# EAGLE design Thermostat-V7 (EAGLE 5.11)
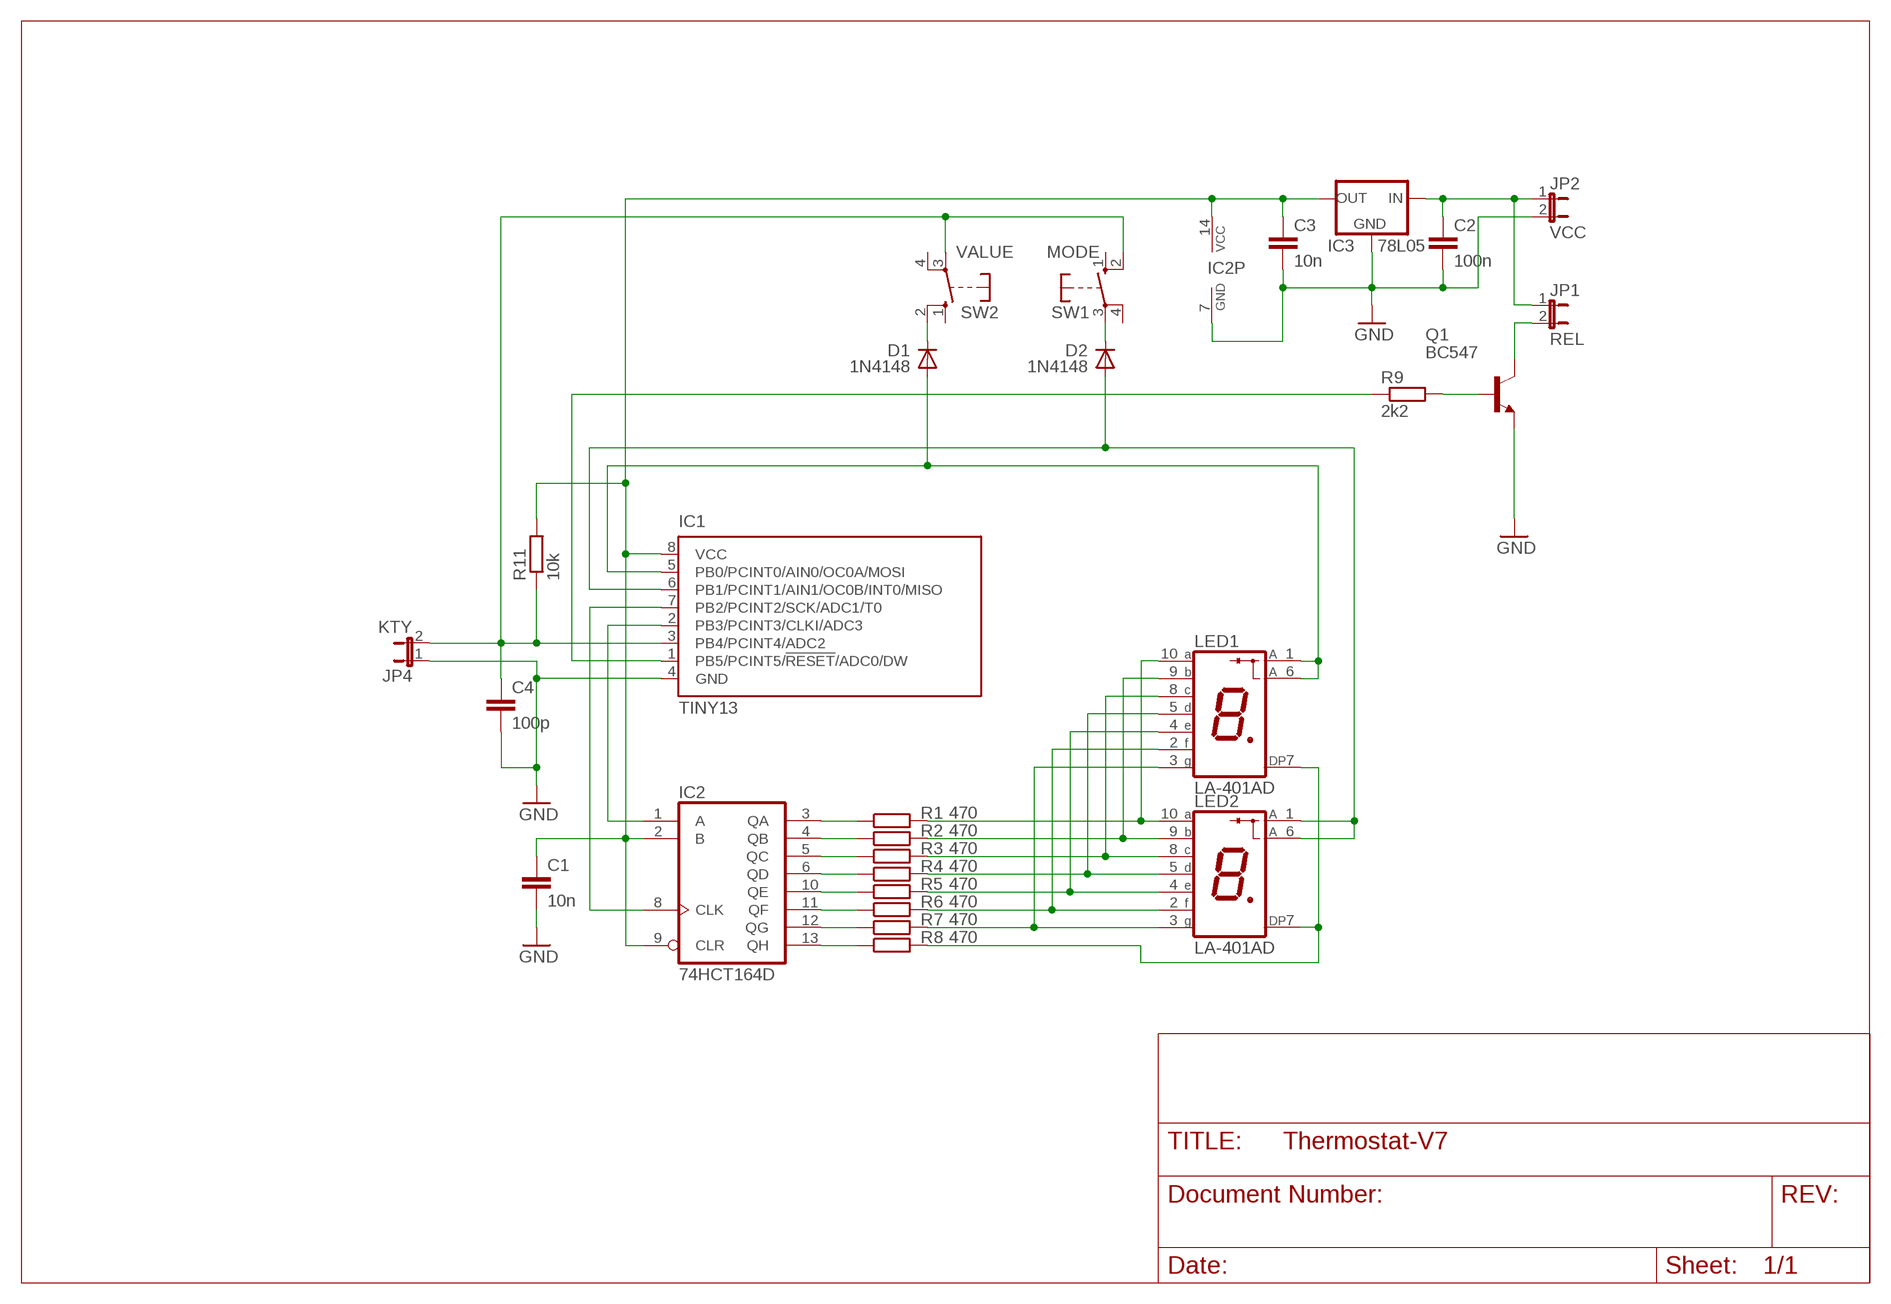
[diagram p0: schematic, sheet 1]

## Parts
C1  10n  C-EU025-024X044  [C025-024X044]
C2  100n  C-EU025-024X044  [C025-024X044]
C3  10n  C-EU025-024X044  [C025-024X044]
C4  100p  C-EU025-024X044  [C025-024X044]
D1  1N4148  1N4148DO35-7  [DO35-7]
D2  1N4148  1N4148DO35-7  [DO35-7]
IC1  TINY13  TINY13-20SU  [8S2]
IC2  74HCT164D  [SO14]
IC3  78L05  78LXX  [78LXX]
JP1  REL  JP1E  [JP1]
JP2  VCC  JP1E  [JP1]
JP4  KTY  JP1E  [JP1]
LED1  LA-401AD  [LA-401]
LED2  LA-401AD  [LA-401]
Q1  BC547  [TO92]
R1  470  R-EU_0204/5  [0204/5]
R2  470  R-EU_0204/5  [0204/5]
R3  470  R-EU_0204/5  [0204/5]
R4  470  R-EU_0204/5  [0204/5]
R5  470  R-EU_0204/5  [0204/5]
R6  470  R-EU_0204/5  [0204/5]
R7  470  R-EU_0204/5  [0204/5]
R8  470  R-EU_0204/5  [0204/5]
R9  2k2  R-EU_0204/5  [0204/5]
R11  10k  R-EU_0204/5  [0204/5]
SW1  MODE  DT6  [DT6]
SW2  VALUE  DT6  [DT6]

## Nets
GND: C1.2 C2.2 C3.2 C4.2 IC1.4(GND) IC2.7(GND) IC3.GND JP2.2 JP4.1 Q1.1(E)
N$1: IC2.3(QA) R1.1
N$2: IC2.4(QB) R2.1
N$3: IC2.5(QC) R3.1
N$4: IC2.6(QD) R4.1
N$5: IC2.10(QE) R5.1
N$6: IC2.11(QF) R6.1
N$7: IC2.12(QG) R7.1
N$8: IC2.13(QH) R8.1
N$9: LED1.10(A) LED2.10(A) R1.2
N$10: LED1.9(B) LED2.9(B) R2.2
N$11: LED1.8(C) LED2.8(C) R3.2
N$12: LED1.5(D) LED2.5(D) R4.2
N$13: LED1.4(E) LED2.4(E) R5.2
N$14: LED1.2(F) LED2.2(F) R6.2
N$15: LED1.3(G) LED2.3(G) R7.2
N$16: LED1.7(DP) LED2.7(DP) R8.2
N$17: C4.1 IC1.3(PB4/PCINT4/ADC2) JP4.2 R11.1 SW1.2(S) SW2.3(P)
N$18: D1.C SW2.2(S)
N$19: D2.C SW1.3(P)
N$23: C2.1 IC3.IN JP1.1 JP2.1
N$26: Q1.2(B) R9.2
N$27: JP1.2 Q1.3(C)
RESET: IC1.1(PB5/PCINT5/!RESET!/ADC0/DW) R9.1
SCI: IC1.2(PB3/PCINT3/CLKI/ADC3) IC2.1(A)
SDI: D1.A IC1.5(PB0/PCINT0/AIN0/OC0A/MOSI) LED1.1(A) LED1.6(A)
SDO: IC1.7(PB2/PCINT2/SCK/ADC1/T0) IC2.8(CLK)
SII: D2.A IC1.6(PB1/PCINT1/AIN1/OC0B/INT0/MISO) LED2.1(A) LED2.6(A)
VCC: C1.1 C3.1 IC1.8(VCC) IC2.2(B) IC2.9(CLR) IC2.14(VCC) IC3.OUT R11.2
Unconnected: SW1.1(S) SW1.4(P) SW2.1(S) SW2.4(P)

## Library data of the parts
C1-C4 = rcl:C-EU: CAPACITOR, European symbol
D1 D2 = diode:1N4148: DIODE high speed (Philips)
IC1 = atmel:TINY13: 8-bit AVR Microcontroller with 1K Bytes In-System Programmable Flash Source: http://www.atmel.com/dyn/resources/prod_documents/2535S.pdf; MPN: ATTINY13-20SU; OC_FARNELL: 9171568; OC_NEWARK: 96K6522
IC2 = 74xx-eu:74*164: 8-bit parallel out SHIFT REGISTER
IC3 = v-reg:78LXX: VOLTAGE REGULATOR
JP1 JP2 JP4 = jumper:JP1E: JUMPER
LED1 LED2 = led-7-segment:LA-401*D: Single Digit LED Numeric Display (anode common) Source: ROHM .. la-1401dn.pdf; OC_FARNELL: unknown; OC_NEWARK: unknown
Q1 = transistor-npn:BC547*: NPN Transistor
R1-R9 R11 = rcl:R-EU_: RESISTOR, European symbol
SW1 SW2 = switch-misc:DT: ITT SWITCH

## Board
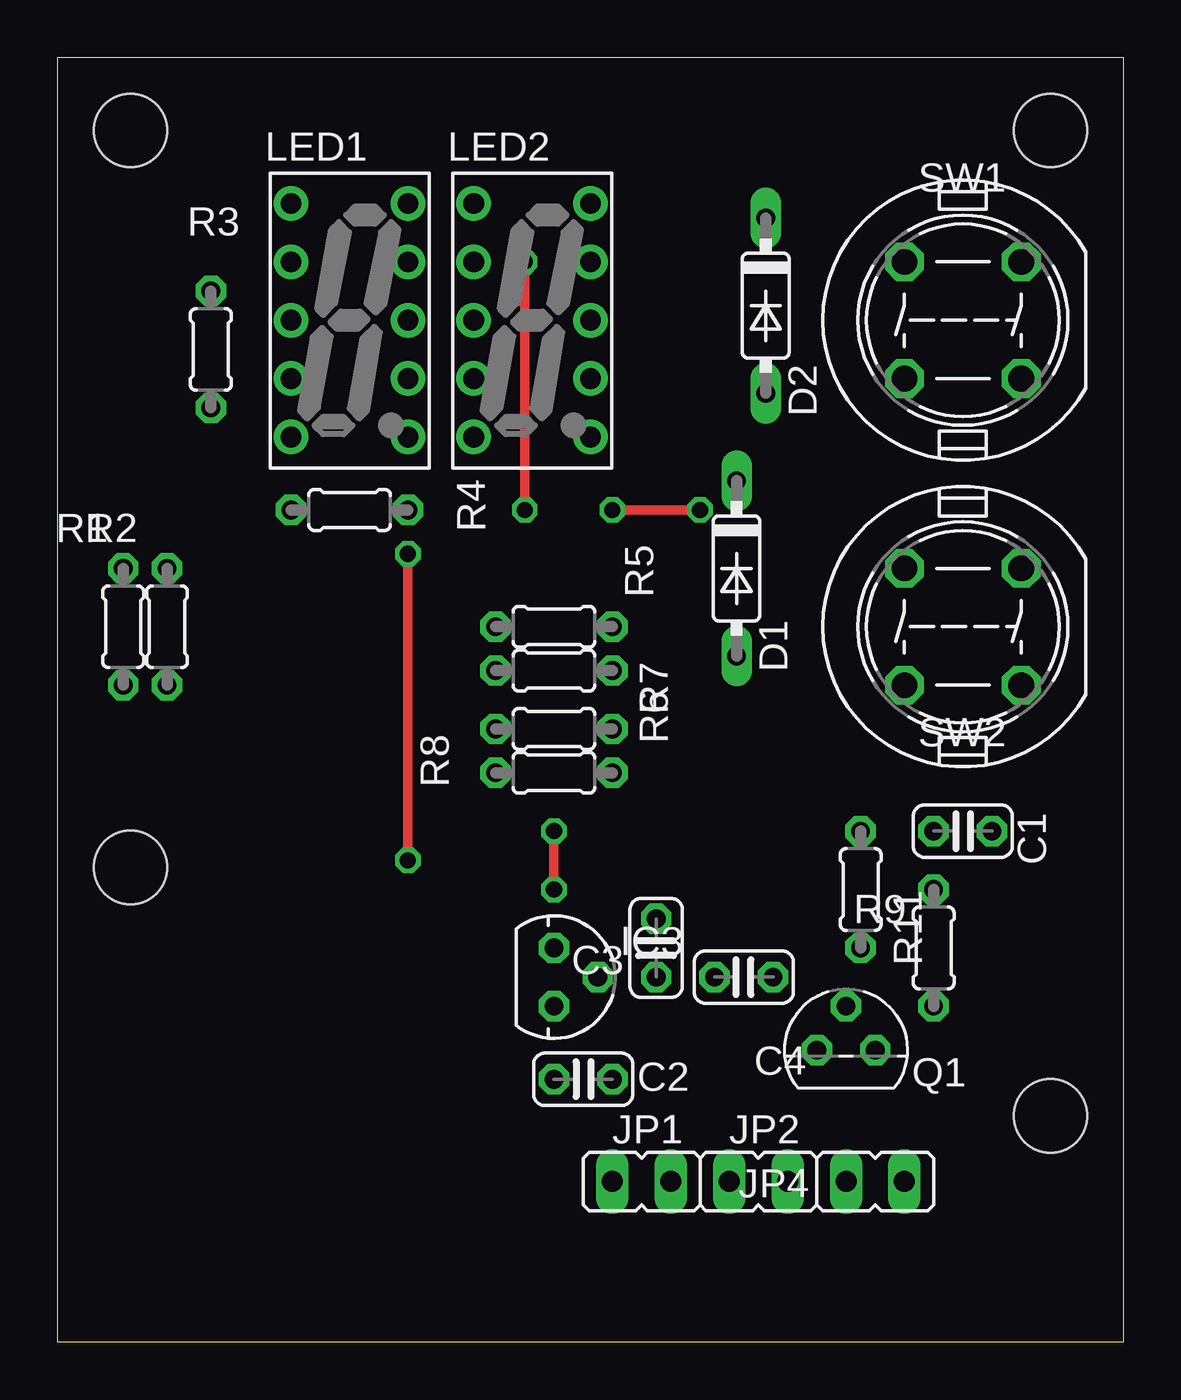
[diagram p1: board, top side]
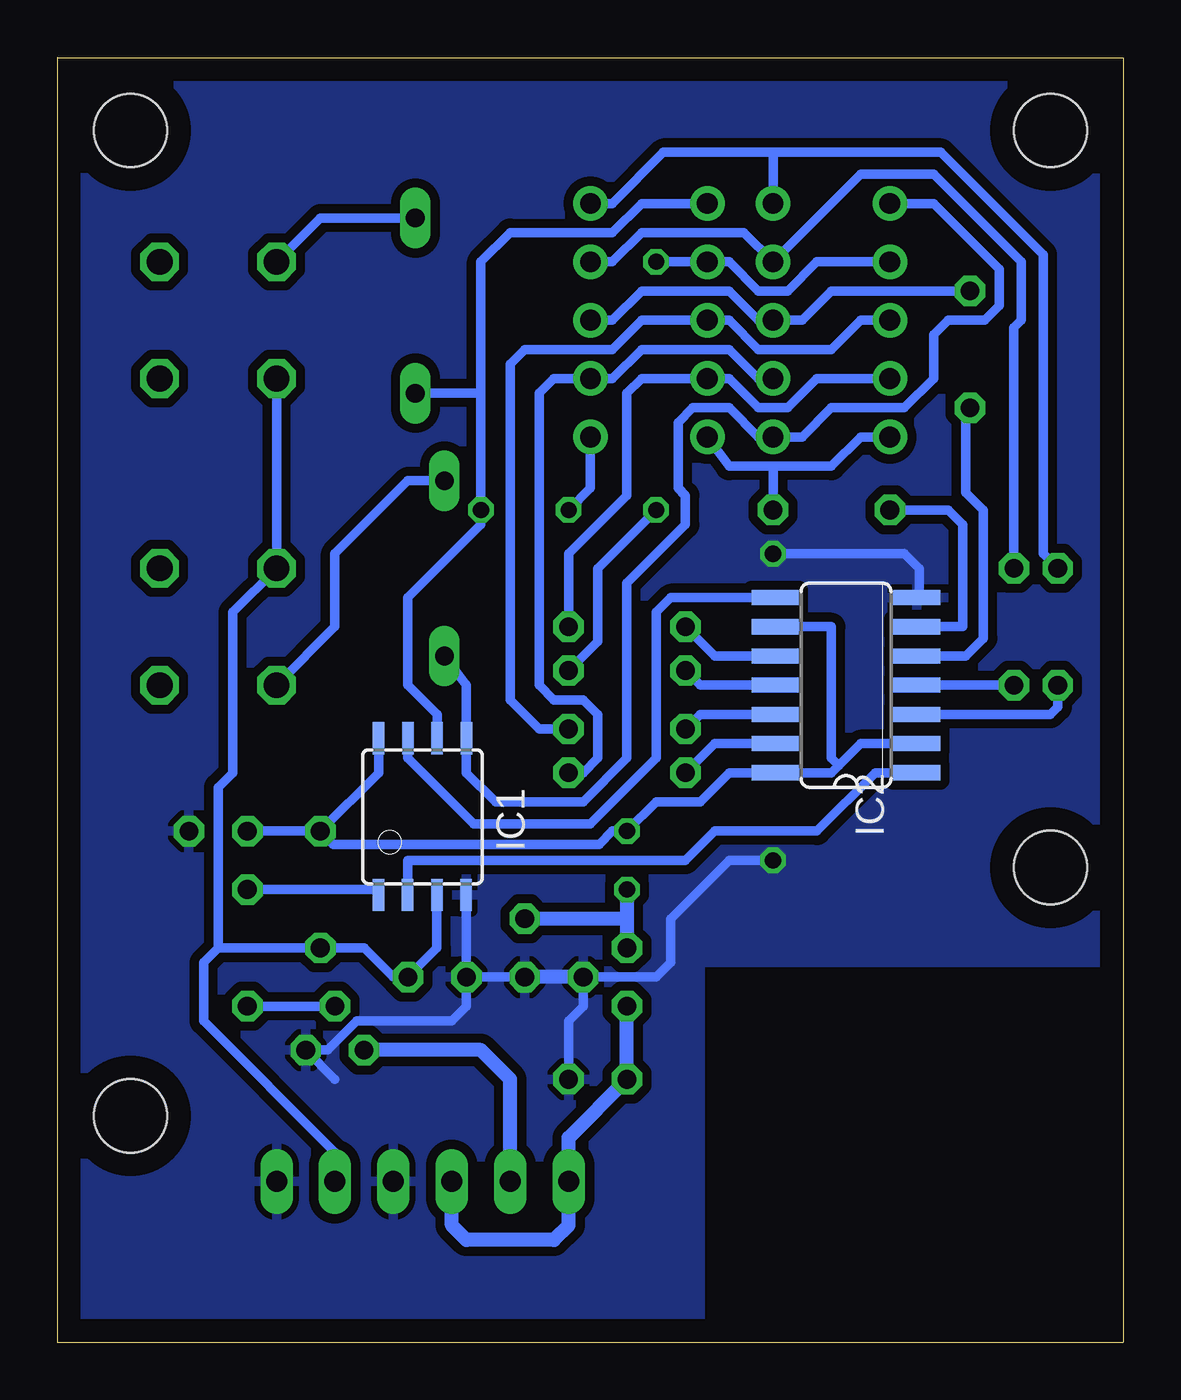
[diagram p2: board, bottom side, seen from below]

Size 46.35 x 55.88 mm. Coordinates in mm from the lower left corner, seen from the top.
Outline: 46.34,55.87 0,55.87 0,0 46.35,0 46.35,55.88
Copper layers (1*16): Top 0.035mm / dielectric 1.5mm / Bottom 0.035mm
Design rules "falcom-16mils *": minimum track width 16mil, minimum drill 24mil, track to track 10mil, track to pad 10mil, pad to pad 10mil, via to via 10mil, smd to smd 10mil, copper to edge 40mil, drill to drill 10mil, minimum pad ring 10mil, minimum via ring 8mil, stop-mask expansion 0mil, vias tented up to drill 0mil, thermal gap 10mil
Holes 3.2 mm at 3.17,52.7 43.18,52.7 43.18,9.84 3.17,20.64

### Footprints (pad centres in the part's own frame; a part is rotated, then mirrored left to right if it is on the bottom)
C025-024X044 = drill 0.813 octagon: 1 -1.27,0; 2 1.27,0
DO35-7 = drill 0.813 long: A 3.81,0; C -3.81,0
8S2 = smd 0.5 x 1.4: 1 -1.905,-3.404; 2 -0.645,-3.404; 3 0.625,-3.404; 4 1.895,-3.404; 5 1.905,3.404; 6 0.635,3.404; 7 -0.635,3.404; 8 -1.905,3.404
SO14 = smd 0.66 x 2.032: 1 -3.81,-3.073; 2 -2.54,-3.073; 3 -1.27,-3.073; 4 0,-3.073; 5 1.27,-3.073; 6 2.54,-3.073; 7 3.81,-3.073; 8 3.81,3.073; 9 2.54,3.073; 10 1.27,3.073; 11 0,3.073; 12 -1.27,3.073; 13 -2.54,3.073; 14 -3.81,3.073
78LXX = drill 0.813 octagon: GND 0,1.905; IN 1.27,0; OUT -1.27,0
JP1 = drill 0.914 long: 1 0,-1.27; 2 0,1.27
LA-401 = drill 0.9 pad 1.5 round: 1 -3.81,5.08; 2 -3.81,2.54; 3 -3.81,0; 4 -3.81,-2.54; 5 -3.81,-5.08; 6 1.27,-5.08; 7 1.27,-2.54; 8 1.27,0; 9 1.27,2.54; 10 1.27,5.08
TO92 = drill 0.813 octagon: 1 1.27,0; 2 0,1.905; 3 -1.27,0
0204/5 = drill 0.813 octagon: 1 -2.54,0; 2 2.54,0
DT6 = drill 1.118 octagon: 1 -2.54,2.54; 2 2.54,2.54; 3 2.54,-2.54; 4 -2.54,-2.54

### Placement (x,y rotation side)
C1  39.37,22.23 0 top
C2  22.86,11.43 0 top
C3  26.04,17.15 270 top
C4  29.84,15.88 180 top
D1  29.53,33.66 270 top
D2  30.8,45.09 270 top
IC1  30.48,22.86 0 bottom
IC2  12.06,28.58 90 bottom
IC3  21.59,15.88 270 top
JP1  25.4,6.98 270 top
JP2  30.48,6.98 270 top
JP4  35.56,6.98 90 top
LED1  13.97,44.45 0 top
LED2  21.91,44.45 0 top
Q1  34.29,12.7 0 top
R1  2.86,31.12 90 top
R2  4.76,31.12 90 top
R3  6.67,43.18 90 top
R4  12.7,36.2 0 top
R5  21.59,31.12 0 top
R6  21.59,29.21 0 top
R7  21.59,26.67 0 top
R8  21.59,24.77 0 top
R9  38.1,17.15 270 top
R11  34.92,19.69 90 top
SW1  39.37,44.45 180 top
SW2  39.37,31.12 180 top

### Tracks (layer width: path | path; a pad name or v marks a point on that pad's centre or on a via)
GND  (via drill 0.7)
  Top 0.406: v15.24,20.96 v15.24,34.29
  Bottom 0.406: IC1.4 28.57,19.45 C4.2 | 34.29,11.43 Q1.1 34.61,12.7 33.34,13.97 29.21,13.97 28.57,14.61 C4.2 | v15.24,34.29 9.53,34.29 8.89,33.66 8.89,32.49 IC2.7 | C3.2 C4.2 | C2.2 24.13,13.97 23.5,14.61 IC3.GND 20.32,15.88 19.68,16.51 19.68,18.42 17.14,20.96 v15.24,20.96
  Bottom 0.61: IC3.GND C3.2
  pour Bottom (isolate 0.406): 0,55.88 46.35,55.88 46.35,0 18.41,0 18.41,16.51 0,16.51
N$1
  Bottom 0.406: IC2.3 3.17,27.31 2.86,27.62 R1.1
N$2
  Bottom 0.406: R2.1 IC2.4
N$3
  Bottom 0.406: IC2.5 6.86,29.85 6.1,30.61 6.1,36.2 6.86,36.96 6.86,40.45 R3.1
N$4
  Bottom 0.406: IC2.6 6.99,31.12 6.99,35.56 7.62,36.2 R4.1
N$5
  Bottom 0.406: IC2.10 17.78,29.85 R5.1
N$6
  Bottom 0.406: IC2.11 18.41,28.58 R6.1
N$7
  Bottom 0.406: IC2.12 18.41,27.31 R7.1
N$8
  Bottom 0.406: IC2.13 17.78,26.04 R8.1
N$9
  Bottom 0.406: LED2.10 22.23,49.53 20,51.75 15.24,51.75 | 15.24,51.75 7.94,51.75 3.49,47.31 3.49,34.29 R1.2 | 15.24,51.75 LED1.10
N$10
  Bottom 0.406: LED2.9 22.23,46.99 20.95,48.26 16.51,48.26 LED1.9 11.43,50.8 8.26,50.8 4.45,46.99 4.45,44.45 4.76,44.13 R2.2
N$11
  Bottom 0.406: R3.2 12.7,45.72 13.97,44.45 LED1.8 15.88,44.45 17.14,45.72 20.95,45.72 22.23,44.45 LED2.8
N$12
  Bottom 0.406: LED1.5 11.43,39.37 12.7,38.1 15.24,38.1 | 15.24,38.1 17.14,38.1 LED2.5 | 15.24,38.1 R4.2
N$13
  Bottom 0.406: LED1.4 13.34,41.91 14.61,40.64 15.88,40.64 17.14,41.91 LED2.4 20.95,41.91 21.59,41.27 21.59,36.83 24.13,34.29 R5.2
N$14  (via drill 0.7)
  Top 0.406: v20.32,36.2 v20.32,46.99
  Bottom 0.406: LED1.2 13.34,46.99 14.61,45.72 15.88,45.72 17.14,46.99 LED2.2 v20.32,46.99 | R6.2 22.86,30.48 22.86,33.66 v20.32,36.2
N$15
  Bottom 0.406: LED1.3 11.43,44.45 12.7,43.18 15.88,43.18 17.14,44.45 LED2.3 20.95,44.45 22.23,43.18 26.04,43.18 26.67,42.54 26.67,27.94 25.4,26.67 R7.2
N$16
  Bottom 0.406: R8.2 23.5,24.77 22.86,25.4 22.86,27.31 23.5,27.94 24.77,27.94 25.4,28.58 25.4,41.27 24.77,41.91 LED2.7 22.23,41.91 20.95,43.18 17.14,43.18 15.88,41.91 LED1.7
N$17
  Bottom 0.406: SW1.2 SW2.3 38.73,31.75 38.73,24.77 39.37,24.13 39.37,17.15 | 29.84,19.45 IC1.3 29.86,17.14 C4.1 31.75,15.88 33.02,17.15 R11.1 39.37,17.15 | 39.37,17.15 40.01,16.51 40.01,13.97 34.29,8.26 JP4.2
N$18
  Bottom 0.406: D1.C 31.11,37.46 34.29,34.29 34.29,31.12 SW2.2
N$19
  Bottom 0.406: D2.C 34.92,48.89 SW1.3
N$23
  Bottom 0.61: JP2.1 29.21,5.08 28.57,4.45 24.77,4.45 24.13,5.08 JP1.1 24.13,8.89 C2.1 IC3.IN
N$26
  Bottom 0.406: Q1.2 R9.2
N$27
  Bottom 0.61: JP1.2 26.67,11.43 27.94,12.7 Q1.3
RESET
  Bottom 0.406: R9.1 32.61,19.69 IC1.1
SCI
  Bottom 0.406: IC2.1 10.79,24.77 13.34,22.23 17.78,22.23 19.05,20.96 31.11,20.96 31.12,20.95 IC1.2
SDI
  Bottom 0.406: LED1.1 8.26,49.53 5.4,46.67 5.4,45.09 6.03,44.45 7.62,44.45 8.26,43.81 8.26,41.91 9.53,40.64 12.7,40.64 13.97,39.37 LED1.6 15.88,39.37 17.14,40.64 18.73,40.64 19.37,40 19.37,37.15 19.05,36.83 19.05,35.56 21.59,33.02 21.59,25.4 23.5,23.5 27.3,23.5 28.57,24.77 IC1.5 28.57,28.58 D1.A
SDO
  Bottom 0.406: IC1.7 31.11,25.4 28.26,22.54 23.18,22.54 20.32,25.4 20.32,31.75 19.68,32.38 IC2.8
SII  (via drill 0.7)
  Top 0.406: v27.94,36.2 v24.13,36.2
  Bottom 0.406: LED2.1 20.95,49.53 22.23,48.26 26.67,48.26 27.94,46.99 27.94,41.27 | IC1.6 29.84,27.31 31.11,28.58 31.11,32.38 27.94,35.56 v27.94,36.2 27.94,41.27 | LED2.6 23.18,37.15 v24.13,36.2 | 27.94,41.27 D2.A
VCC  (via drill 0.7)
  Top 0.406: v21.59,22.23 v21.59,19.69
  Bottom 0.406: IC2.2 11.43,26.04 12.38,25.08 | 12.38,25.08 12.7,24.77 IC2.14 17.14,24.77 18.41,23.5 20.32,23.5 v21.59,22.23 22.23,22.23 22.8,21.65 34.35,21.65 R11.2 | IC2.9 12.7,31.12 12.7,25.4 12.38,25.08 | R11.2 C1.1 | IC1.8 32.38,24.77 R11.2
  Bottom 0.61: v21.59,19.69 21.59,18.42 | 21.59,18.42 IC3.OUT | 21.59,18.42 C3.1